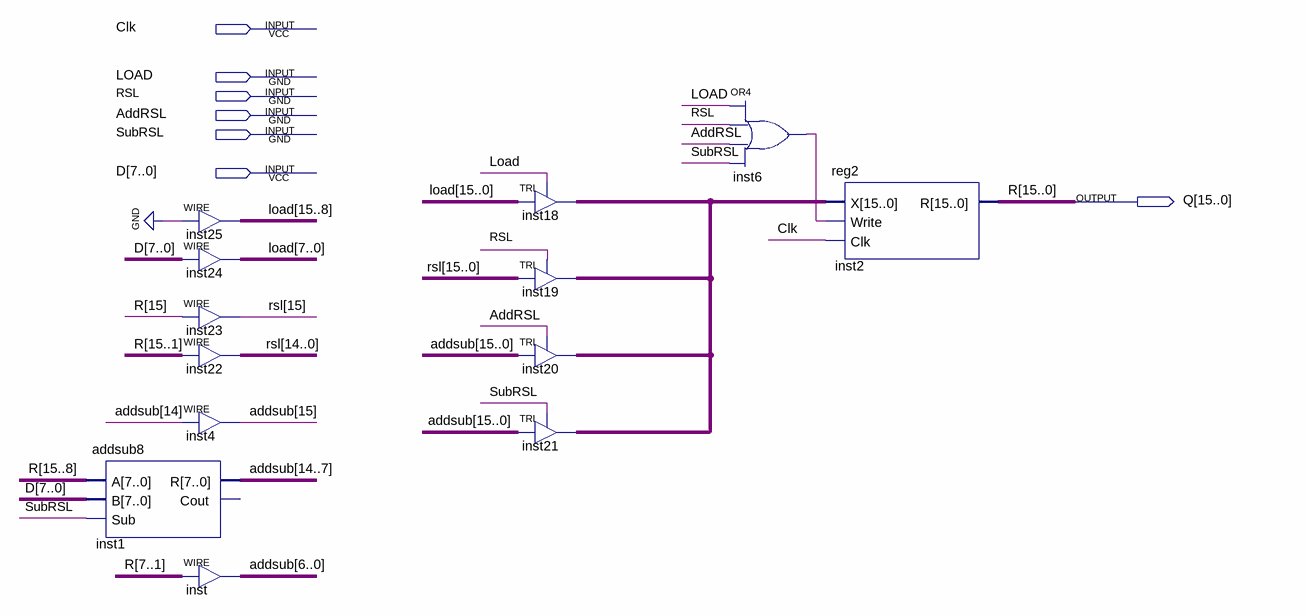
[diagram p0: schematic sheet]
// Quartus schematic unireg_addsub.bdf as structural Verilog: 13 symbols, 7 pins
module unireg_addsub (
  input  Clk,
  input  LOAD,
  input  RSL,
  input  AddRSL,
  input  SubRSL,
  input  [7:0] D,
  output [15:0] Q
);

  wire inst6_out;
  wire [15:0] addsub, inst18_out, LOAD_bus, RSL_bus;

  addsub8 inst1 (.A(Q[15:8]), .B(D), .Sub(SubRSL), .R(addsub[14:7]));  // open: Cout
  assign LOAD_bus[15:8] = {8{1'b0}};  // WIRE inst25
  assign LOAD_bus[7:0] = D;  // WIRE inst24
  assign RSL_bus[15] = Q[15];  // WIRE inst23
  assign RSL_bus[14:0] = Q[15:1];  // WIRE inst22
  assign addsub[15] = addsub[14];  // WIRE inst4
  assign addsub[6:0] = Q[7:1];  // WIRE inst
  TRI inst18[15:0] (.IN(LOAD_bus), .OE(LOAD), .OUT(inst18_out));
  TRI inst19[15:0] (.IN(RSL_bus), .OE(RSL), .OUT(inst18_out));
  TRI inst20[15:0] (.IN(addsub), .OE(AddRSL), .OUT(inst18_out));
  TRI inst21[15:0] (.IN(addsub), .OE(SubRSL), .OUT(inst18_out));
  or inst6 (inst6_out, LOAD, RSL, AddRSL, SubRSL);
  reg2 inst2 (.X(inst18_out), .Write(inst6_out), .Clk(Clk), .R(Q));

  // Other names for the same wires on the sheet: R[15:0] = Q
endmodule
